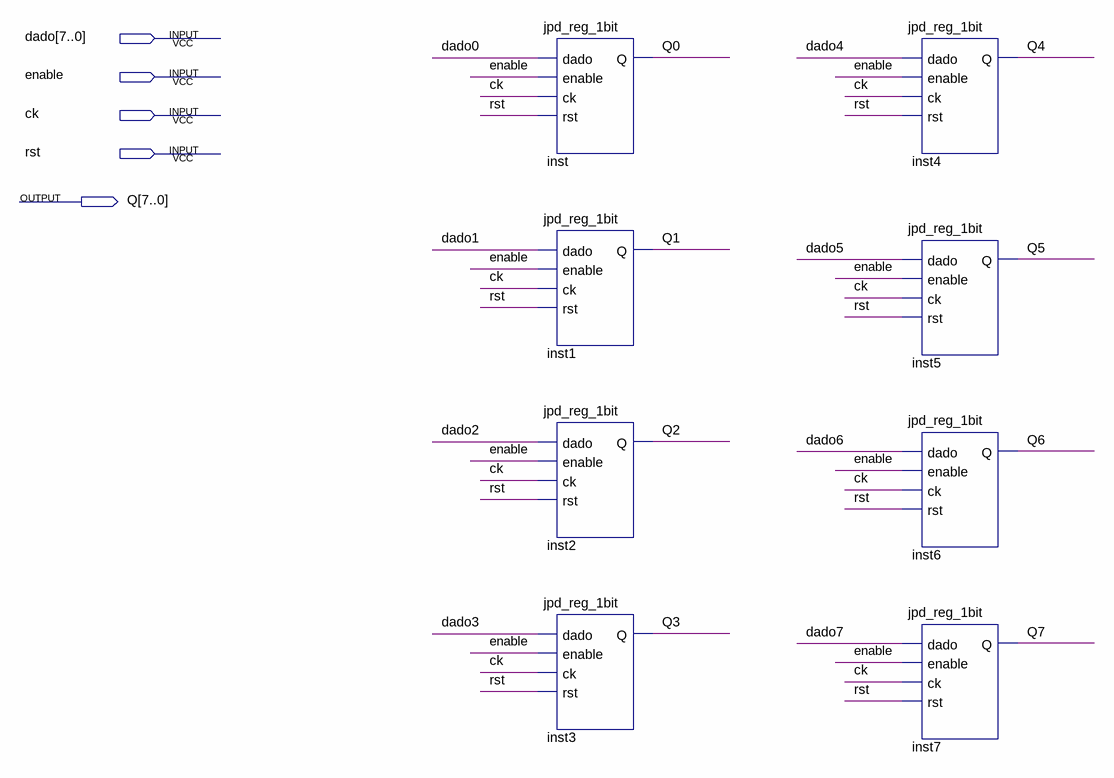
[diagram p0: schematic sheet]
// Quartus schematic jpd_reg_8bit.bdf as structural Verilog: 8 symbols, 5 pins
module jpd_reg_8bit (
  input  [7:0] dado,
  input  enable,
  input  ck,
  input  rst,
  output [7:0] Q
);

  jpd_reg_1bit inst (.dado(dado[0]), .enable(enable), .ck(ck), .rst(rst), .Q(Q[0]));
  jpd_reg_1bit inst1 (.dado(dado[1]), .enable(enable), .ck(ck), .rst(rst), .Q(Q[1]));
  jpd_reg_1bit inst2 (.dado(dado[2]), .enable(enable), .ck(ck), .rst(rst), .Q(Q[2]));
  jpd_reg_1bit inst3 (.dado(dado[3]), .enable(enable), .ck(ck), .rst(rst), .Q(Q[3]));
  jpd_reg_1bit inst4 (.dado(dado[4]), .enable(enable), .ck(ck), .rst(rst), .Q(Q[4]));
  jpd_reg_1bit inst5 (.dado(dado[5]), .enable(enable), .ck(ck), .rst(rst), .Q(Q[5]));
  jpd_reg_1bit inst6 (.dado(dado[6]), .enable(enable), .ck(ck), .rst(rst), .Q(Q[6]));
  jpd_reg_1bit inst7 (.dado(dado[7]), .enable(enable), .ck(ck), .rst(rst), .Q(Q[7]));
endmodule
